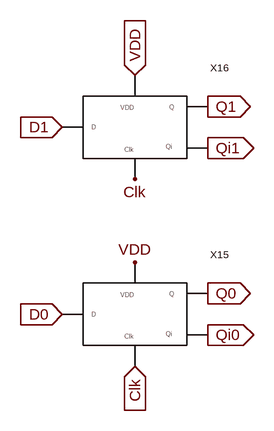
[diagram p0: schematic 2_bit_register.asc]
2_bit_register.asc, the LTspice schematic file:
Version 4
SHEET 1 880 932
FLAG -944 672 VDD
FLAG -944 832 Clk
IOPIN -944 832 In
FLAG -1056 752 D0
IOPIN -1056 752 In
FLAG -832 720 Q0
IOPIN -832 720 Out
FLAG -832 784 Qi0
IOPIN -832 784 Out
FLAG -944 384 VDD
IOPIN -944 384 In
FLAG -944 544 Clk
FLAG -1056 464 D1
IOPIN -1056 464 In
FLAG -832 432 Q1
IOPIN -832 432 Out
FLAG -832 496 Qi1
IOPIN -832 496 Out
SYMBOL DFF -1024 800 R0
SYMATTR InstName X15
SYMBOL DFF -1024 512 R0
SYMATTR InstName X16

The netlist it stands for:
* 2_bit_register.asc
XX15 D0 Clk Q0 Qi0 VDD DFF  ; pins D Clk Q Qi VDD
XX16 D1 Clk Q1 Qi1 VDD DFF  ; pins D Clk Q Qi VDD
.backanno
.end